# EAGLE design fauxbee (EAGLE 5.08)
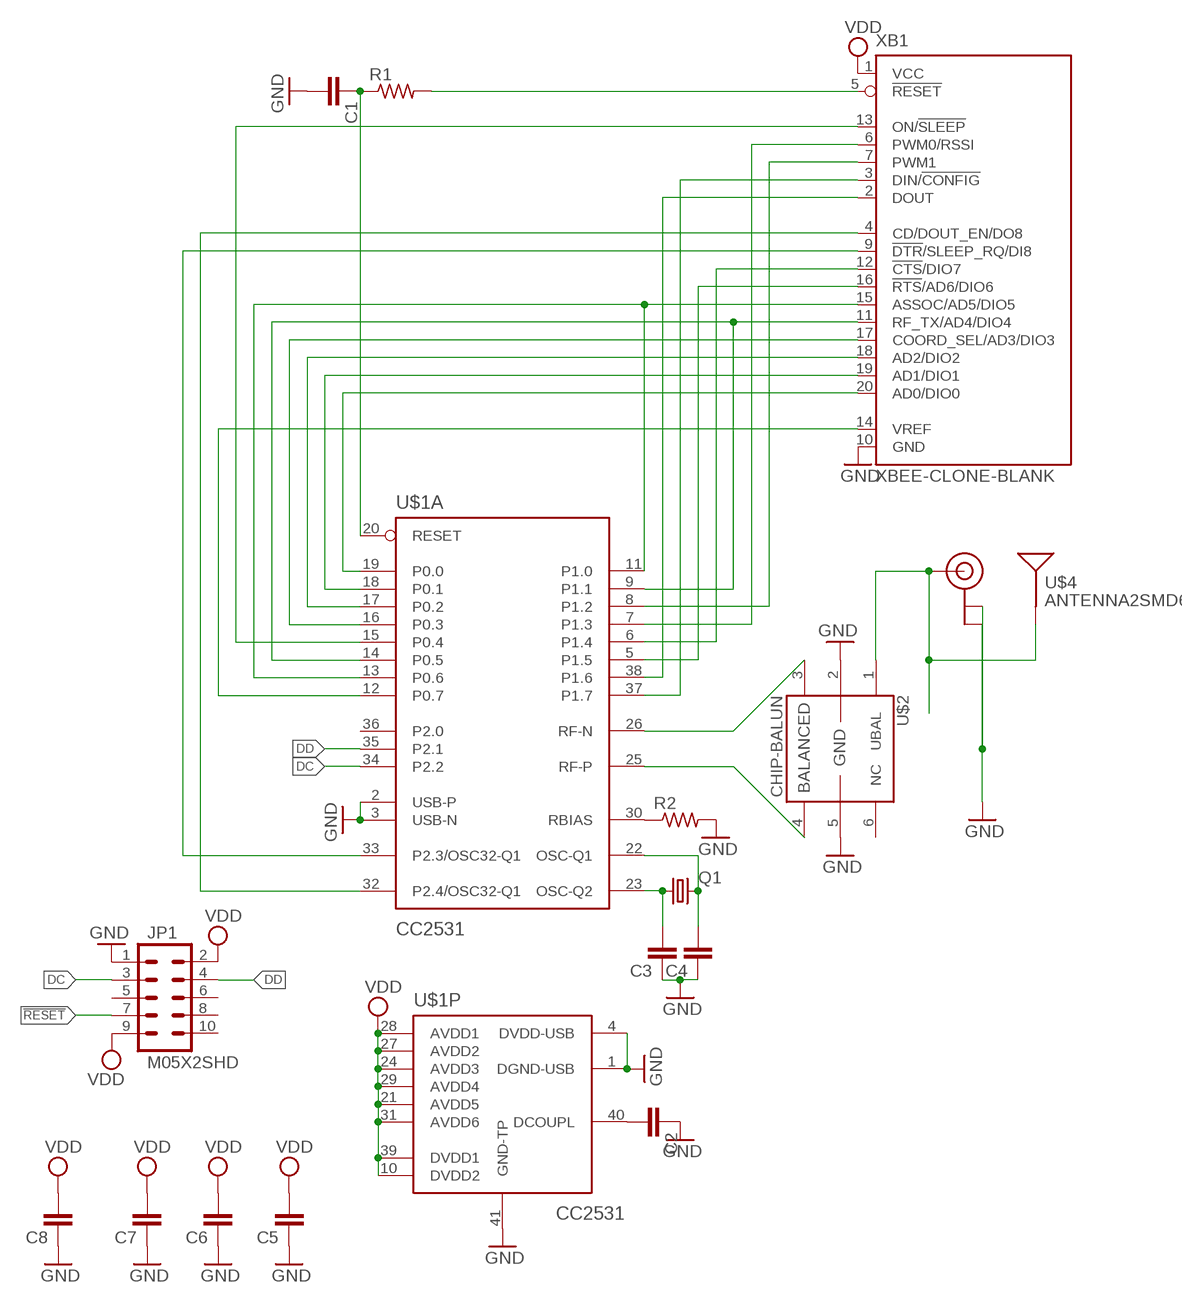
[diagram p0: schematic, sheet 1]

## Parts
C1  C-EUC0402  [C0402]
C2  C-EUC0402  [C0402]
C3  C-EUC0402  [C0402]
C4  C-EUC0402  [C0402]
C5  C-EUC0402  [C0402]
C6  C-EUC0402  [C0402]
C7  C-EUC0402  [C0402]
C8  C-EUC0402  [C0402]
JP1  M05X2SHD  [2X5-SHROUDED]
Q1  CRYSTAL5X3  [CRYSTAL-SMD-5X3]
R1  R-US_R0402  [R0402]
R2  R-US_R0402  [R0402]
U$1  CC2531  [QFN50P600X600X100-41N]
U$2  CHIP-BALUN  [EIA0805]
U$3  U.FL  [U.FL]
U$4  ANTENNA2SMD6  [ANTENNA-CHIP6]
XB1  XBEE-CLONE-BLANK  [XBEE-BLANK]

## Nets
!CTS: U$1.6(P1.4) XB1.12(!CTS!/DIO7)
!DTR: U$1.33(P2.3/OSC32-Q1) XB1.9(!DTR!/SLEEP_RQ/DI8)
!RESET: JP1.7 R1.2 XB1.5(!RESET)
!RTS: U$1.5(P1.5) XB1.16(!RTS!/AD6/DIO6)
AD0: U$1.19(P0.0) XB1.20(AD0/DIO0)
AD1: U$1.18(P0.1) XB1.19(AD1/DIO1)
AD2: U$1.17(P0.2) XB1.18(AD2/DIO2)
AD3: U$1.16(P0.3) XB1.17(COORD_SEL/AD3/DIO3)
AD4: U$1.9(P1.1) U$1.14(P0.5) XB1.11(RF_TX/AD4/DIO4)
AD5: U$1.11(P1.0) U$1.13(P0.6) XB1.15(ASSOC/AD5/DIO5)
CD: U$1.32(P2.4/OSC32-Q1) XB1.4(CD/DOUT_EN/DO8)
DC: JP1.3 U$1.34(P2.2)
DD: JP1.4 U$1.35(P2.1)
DIN: U$1.37(P1.7) XB1.3(DIN/!CONFIG)
DOUT: U$1.38(P1.6) XB1.2(DOUT)
GND: C1.2 C2.1 C3.1 C4.1 C5.1 C6.1 C7.1 C8.1 JP1.1 R2.2 U$1.1(DGND-USB) U$1.2(USB-P) U$1.3(USB-N) U$1.4(DVDD-USB) U$1.41(GND-TP) U$2.2(GND1) U$2.5(GND2) U$3.P$1(GND) U$3.P$2(GND) XB1.10(GND)
N$1: U$2.1(UBAL) U$3.P$3(SIGNAL) U$4.1(SIGNAL)
N$2: U$1.26(RF-N) U$2.3(BAL1)
N$3: U$1.25(RF-P) U$2.4(BAL2)
N$4: R2.1 U$1.30(RBIAS)
N$5: C2.2 U$1.40(DCOUPL)
N$6: C3.2 C4.2 Q1.1 Q1.3 U$1.22(OSC-Q1) U$1.23(OSC-Q2)
ON/!SLEEP: U$1.15(P0.4) XB1.13(ON/!SLEEP)
PWM0: U$1.7(P1.3) XB1.6(PWM0/RSSI)
PWM1: U$1.8(P1.2) XB1.7(PWM1)
UNFILTERED_!RESET: C1.1 R1.1 U$1.20(RESET)
VDD: C5.2 C6.2 C7.2 C8.2 JP1.2 JP1.9 U$1.10(DVDD2) U$1.21(AVDD5) U$1.24(AVDD3) U$1.27(AVDD2) U$1.28(AVDD1) U$1.29(AVDD4) U$1.31(AVDD6) U$1.39(DVDD1) XB1.1(VCC)
VREF: U$1.12(P0.7) XB1.14(VREF)
Unconnected: JP1.5 JP1.6 JP1.8 JP1.10 U$1.36(P2.0) U$2.6(NC)

## Library data of the parts
C1-C8 = 0common:C-EU: CAPACITOR, European symbol
JP1 = SparkFun:M05X2: Header 5x2 Standard 10-pin dual row 0.1" header. Commonly used with AVR-ISP. Use with Spark Fun Electronics SKU: PRT-00778
Q1 = SparkFun:CRYSTAL: Crystals Various standard crystals. Proven footprints. Spark Fun Electronics SKU : COM-00534
R1 R2 = 0common:R-US_: RESISTOR, American symbol
U$1 = chipcon-ti-v2:CC2531: A USB Enabled System-On-Chip Solution for 2.4-GHz IEEE 802.15.4 and ZigBee Applications
U$2 = 0common:CHIP-BALUN
U$3 = SparkFun:U.FL
U$4 = SparkFun:ANTENNA2: Antenna Single endded antenna. Common with smaller chip antennas. CHIP4 package is the GPS Chip Antenna SKU: GPS-08418. CHIP5 package is 2.4GHz chip antenna SKU: WRL-00144.
XB1 = maxstream:XBEE-CLONE: XBee (TM) /XBee-PRO(TM) OEM RF Modules Source: MaxStream, Inc. xbee_productmanual.pdf

## Board
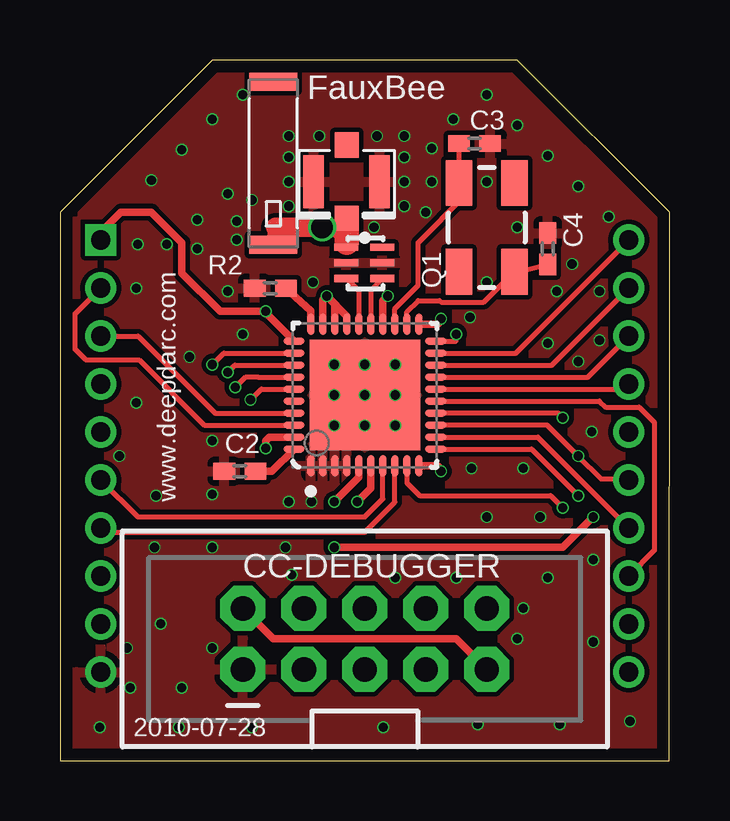
[diagram p1: board, top side]
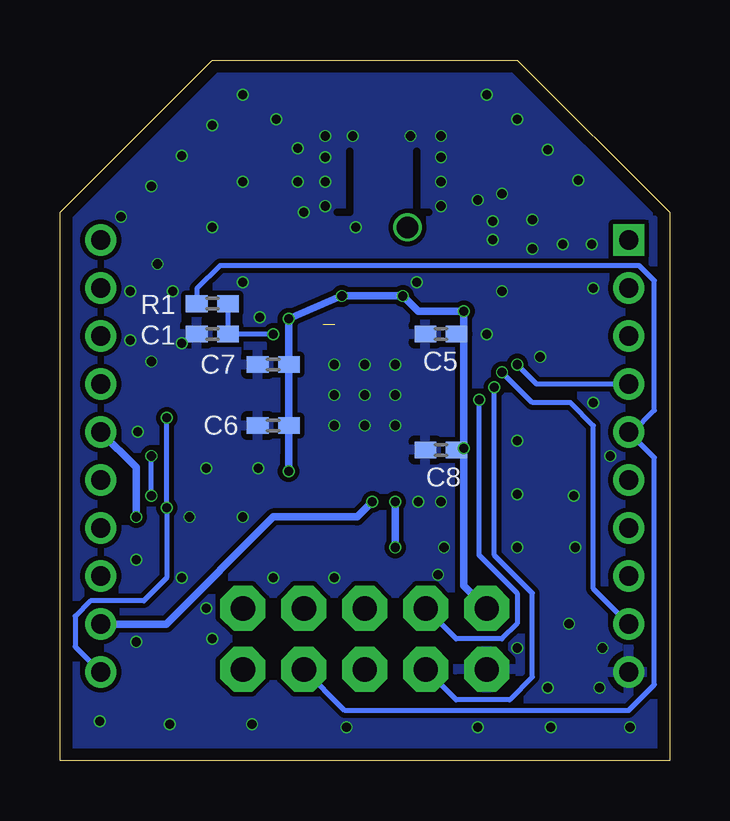
[diagram p2: board, bottom side, seen from below]

Size 25.4 x 29.2 mm. Coordinates in mm from the lower left corner, seen from the top.
Outline: 0,0 25.39,0 25.4,22.86 19.06,29.2 6.34,29.2 0,22.86 0,0
Copper layers (1*16): Top 0.035mm / dielectric 1.5mm / Bottom 0.035mm
Design rules "default *": minimum track width 0.1969mm, minimum drill 15mil, track to track 0.1969mm, track to pad 0.1969mm, pad to pad 0.1969mm, via to via 0.1969mm, smd to smd 0.1969mm, copper to edge 20mil, drill to drill 0.1969mm, minimum pad ring 10mil, minimum via ring 2mil, stop-mask expansion 4mil, vias tented up to drill 0mil, thermal gap 10mil
bRestrict: 4 lines

### Footprints (pad centres in the part's own frame; a part is rotated, then mirrored left to right if it is on the bottom)
C0402 = smd 0.9 x 0.7: 1 -0.65,0; 2 0.65,0
2X5-SHROUDED = drill 1.016 pad 1.88 octagon: 1 -1.27,5.08; 2 1.27,5.08; 3 -1.27,2.54; 4 1.27,2.54; 5 -1.27,0; 6 1.27,0; 7 -1.27,-2.54; 8 1.27,-2.54; 9 -1.27,-5.08; 10 1.27,-5.08
CRYSTAL-SMD-5X3 = smd 1.9 x 1.1: 1 -1.85,-1.15; 2 1.85,-1.15; 3 1.85,1.15; 4 -1.85,1.15
R0402 = smd 0.9 x 0.7: 1 -0.65,0; 2 0.65,0
QFN50P600X600X100-41N = smd 0.9 x 0.3: 1 -2.95,2.25; 2 -2.95,1.75; 3 -2.95,1.25; 4 -2.95,0.75; 5 -2.95,0.25; 6 -2.95,-0.25; 7 -2.95,-0.75; 8 -2.95,-1.25; 9 -2.95,-1.75; 10 -2.95,-2.25; 21 2.95,-2.25; 22 2.95,-1.75; 23 2.95,-1.25; 24 2.95,-0.75; 25 2.95,-0.25; 26 2.95,0.25; 27 2.95,0.75; 28 2.95,1.25; 29 2.95,1.75; 30 2.95,2.25 | smd 0.3 x 0.9: 11 -2.25,-2.95; 12 -1.75,-2.95; 13 -1.25,-2.95; 14 -0.75,-2.95; 15 -0.25,-2.95; 16 0.25,-2.95; 17 0.75,-2.95; 18 1.25,-2.95; 19 1.75,-2.95; 20 2.25,-2.95; 31 2.25,2.95; 32 1.75,2.95; 33 1.25,2.95; 34 0.75,2.95; 35 0.25,2.95; 36 -0.25,2.95; 37 -0.75,2.95; 38 -1.25,2.95; 39 -1.75,2.95; 40 -2.25,2.95 | smd 4.6 x 4.6: 41 0,0
EIA0805 = smd 0.3 x 1: 1 0.698,0.765; 2 0.048,0.765; 3 -0.603,0.765; 4 -0.603,-0.735; 5 0.048,-0.735; 6 0.698,-0.735
U.FL = smd 2.2 x 0.85: P$1 0,1.375; P$2 0,-1.375 | smd 1.05 x 1: P$3 1.525,0; P$4 -1.525,0
ANTENNA-CHIP6 = smd 0.75 x 2: 1 -3.4,0; NC 3.4,0
XBEE-BLANK = drill 0.8 pad 1.27 square: 1 -11,9 | drill 0.8 pad 1.27 round: 2 -11,7; 3 -11,5; 4 -11,3; 5 -11,1; 6 -11,-1; 7 -11,-3; 8 -11,-5; 9 -11,-7; 10 -11,-9; 11 11,-9; 12 11,-7; 13 11,-5; 14 11,-3; 15 11,-1; 16 11,1; 17 11,3; 18 11,5; 19 11,7; 20 11,9

### Placement (x,y rotation side)
C1  19.05,17.78 180 bottom
C2  7.49,12.06 0 top
C3  17.27,25.72 180 top
C4  20.32,21.34 270 top
C5  9.53,17.78 0 bottom
C6  16.51,13.97 0 bottom
C7  16.51,16.51 0 bottom
C8  9.53,12.95 0 bottom
JP1  12.7,5.08 90 top
Q1  17.78,22.23 90 top
R1  19.05,19.05 180 bottom
R2  8.76,19.68 180 top
U$1  12.7,15.24 90 top
U$2  12.7,20.7 90 top
U$3  11.94,24.13 270 top
U$4  8.89,24.89 90 top
XB1  12.7,12.7 0 top

### Tracks (layer width: path | path; a pad name or v marks a point on that pad's centre or on a via)
!CTS  (via drill 0.38)
  Top 0.305: v12.38,10.79 12.95,11.36 U$1.6
  Bottom 0.305: XB1.12 20.97,5.7 16.51,10.16 13.02,10.16 v12.38,10.79
!DTR  (via drill 0.38)
  Top 0.203: U$1.33 7.28,16.49 v6.99,16.19
  Bottom 0.203: XB1.9 3.17,7.17 3.17,13.97 4.13,14.92 5.71,14.92 v6.99,16.19
!RESET
  Bottom 0.203: XB1.5 0.64,12.63 0.64,3.17 1.71,2.1 13.53,2.1 JP1.7 | 1.54,13.7 0.64,14.61 0.64,20 1.27,20.64 18.73,20.64 19.7,19.67 R1.2
  Bottom 0.305: XB1.5 1.54,13.7
!RTS  (via drill 0.38)
  Top 0.305: v22.23,10.16 20.95,8.89 v11.43,8.89 | v11.43,10.79 12.45,11.81 U$1.5
  Bottom 0.305: XB1.16 22.23,12.22 v22.23,10.16 | v11.43,8.89 v11.43,10.79
AD0
  Top 0.203: XB1.20 18.99,16.99 U$1.19
AD1
  Top 0.203: XB1.19 20.49,16.49 U$1.18
AD2
  Top 0.203: XB1.18 21.99,15.99 U$1.17
AD3
  Top 0.203: XB1.17 23.49,15.49 U$1.16
AD4  (via drill 0.38)
  Top 0.203: U$1.14 20.75,14.49 v20.95,14.29 | U$1.9 14.45,11.59 14.99,11.05 20.45,11.05 v20.95,10.54
  Bottom 0.203: XB1.11 24.77,4.76 24.77,6.03 24.13,6.67 21.91,6.67 20.95,7.62 v20.95,10.54 v20.95,14.29
AD5  (via drill 0.38)
  Top 0.203: XB1.15 23.81,11.75 22.54,11.75 v21.59,12.7 20.3,13.99 U$1.13 | U$1.11 19.65,12.99 v21.59,11.05
  Bottom 0.203: v21.59,11.05 v21.59,12.7
CD  (via drill 0.38)
  Top 0.203: U$1.32 6.83,16.99 v6.35,16.51
  Bottom 0.203: XB1.4 5.54,15.7 v6.35,16.51
DC  (via drill 0.38)
  Top 0.203: v7.3,15.56 7.75,16 8.26,16 8.24,15.99 U$1.34
  Bottom 0.203: JP1.3 8.89,2.54 6.67,2.54 5.71,3.49 5.71,6.99 7.3,8.57 v7.3,15.56
DD  (via drill 0.38)
  Top 0.203: v7.94,15.05 8.39,15.49 U$1.35
  Bottom 0.203: JP1.4 8.89,5.08 6.99,5.08 6.35,5.71 6.35,6.99 7.94,8.57 v7.94,15.05
DIN
  Top 0.203: XB1.3 3.25,17.7 6.46,14.49 U$1.37
DOUT
  Top 0.203: XB1.2 0.64,18.64 0.64,17.14 1.08,16.7 3.3,16.7 6.01,13.99 U$1.38
GND  (via drill 0.38)
  other vias: 12.7,15.24 20,10.16 17.78,10.16 13.97,7.62 16.51,7.62 10.48,10.79 9.53,10.79 6.35,11.11 6.35,13.34 4,11.05 3.17,14.92 5.4,16.83 7.62,17.78 6.99,19.56 3.17,19.68 7.37,21.72 3.24,21.53 5.71,22.54 17.08,18.48 15.24,22.86 20.7,19.56 21.34,20.7 14.35,23.11 14.35,24.13 14.35,25.15 9.53,25.15 9.53,24.13 9.53,23.11 13.97,16.51 13.97,13.97 12.7,13.97 11.43,13.97 11.43,15.24 11.43,16.51 12.7,16.51 6.35,8.89 9.4,8.89 3.94,8.89 9.65,7.75 20.32,7.62 22.23,8.38 19.05,5.08 22.23,4.95 19.3,6.35 6.35,4.7 5.08,3.05 2.79,4.7 2.92,3.05 4.19,5.71 17.14,12.19 19.3,12.19 22.16,13.72 23.75,1.65 20.83,1.52 17.4,1.52 13.46,1.4 8,1.4 4.95,1.4 1.65,1.4 2.48,12.7 3.81,24.19 5.08,25.46 6.35,26.73 7.62,27.75 17.78,27.75 19.05,26.48 20.32,25.21 21.59,23.94 22.86,22.67 13.97,15.24 7.37,22.48 6.99,23.62 8,23.37 13.08,22.23 9.53,26.04 15.49,24.13 15.49,25.53 16.38,26.73 19.05,22.23 17.78,24.13 17.78,19.94 4.45,21.53 20.32,17.4 22.48,19.56 21.59,16.64 22.48,17.53 10.54,19.94 5.71,21.34 10.79,26.04 14.35,26.04 13.21,26.04
  pour Bottom: 0,29.21 25.4,29.21 25.4,0 0,0
  pour Top: 0,29.21 25.4,29.21 25.4,0 0,0
N$1  (via drill 0.9 pad 1.02)
  Top 0.203: v10.92,22.23 11.24,22.1 U$2.1
  Top 0.254: U$2.1 11.94,22.86 11.94,21.59
  Top 0.61: U$4.1 8.99,22.23
  Top 0.813: 8.99,22.23 v10.92,22.23
  Top 1.016: 11.94,21.59 U$3.P$3
N$2
  Top 0.203: U$1.26 12.45,19.58 U$2.3
N$3
  Top 0.203: U$1.25 12.95,19.61 U$2.4
N$4
  Top 0.305: R2.1 10.45,18.76 U$1.30
N$5
  Top 0.305: C2.2 8.82,12.06 U$1.40
N$6  (1 unrouted)
  Top 0.203: U$1.23 13.95,18.84 14.92,19.81 14.92,21.59 16.89,23.56 16.89,23.81 Q1.3 16.63,25.22 C3.2 | U$1.22 14.45,18.7 14.92,19.18 15.81,19.18 15.88,19.11 17.65,19.11 Q1.1 19.12,20.38 C4.2
ON/!SLEEP
  Top 0.203: XB1.13 24.77,8.77 24.77,14.1 24.13,14.73 22.73,14.73 22.48,14.99 U$1.15
PWM0
  Top 0.203: XB1.6 3.24,10.16 12.7,10.16 13.45,10.91 U$1.7
PWM1
  Top 0.203: XB1.7 1.88,9.53 12.7,9.53 13.95,10.78 U$1.8
UNFILTERED_!RESET  (via drill 0.38)
  Top 0.203: U$1.20 16.51,17.49 v16.51,17.78
  Bottom 0.203: R1.1 C1.1 v16.51,17.78
VDD  (via drill 0.38)
  Top 0.305: v8.57,13.02 8.57,13.34 8.73,13.49 U$1.39 | U$1.29 10.95,19.2 v11.11,19.37 | U$1.28 11.45,19.03 v11.11,19.37 | U$1.27 11.95,18.53 v11.11,19.37 | v13.65,19.37 13.45,19.16 U$1.24 | U$1.21 15.65,18.19 arc90 v15.88,18.41 | U$1.10 15.65,12.29 arc-90 v15.88,12.06 | JP1.9 16.51,5.08 8.89,5.08 JP1.2 | XB1.1 1.7,22.02 2.54,22.86 3.81,22.86 5.08,21.59 5.08,20.32 6.67,18.73 v8.57,18.73 8.57,18.67 U$1.31
  Bottom 0.203: 8.57,17.78 C5.2 | C7.2 15.88,16.52 15.88,17.78 | C6.2 15.88,13.96 15.88,12.7
  Bottom 0.305: JP1.2 8.57,7.3 v8.57,13.02 | v8.57,13.02 8.57,17.78 v8.57,18.73 10.48,18.73 v11.11,19.37 v13.65,19.37 v15.88,18.41 15.88,17.78 15.88,12.7 v15.88,12.06 | v8.57,13.02 8.64,12.95 C8.2
VREF
  Top 0.203: XB1.14 19.91,13.49 U$1.12

### Text on the board
tNames: FauxBee | www.deepdarc.com | CC-DEBUGGER | 2010-07-28